# Altium schematic sheet CH340N_C2977777.schdoc
size 127 x 101 mm
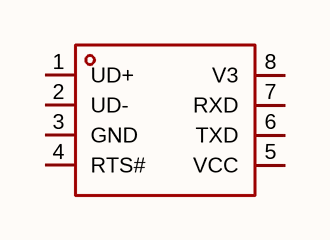
[diagram p0: CH340N_C2977777.schdoc]

## Parts
U?  ch340n  [SOP-8_L4.9-W3.9-P1.27-LS6.0-BL]  (value not drawn)

## Nets

Not connected (* = marked no-connect by the designer): U? 1(UD+) 2(UD-) 3(GND) 4(RTS#) 5(VCC) 6(TXD) 7(RXD) 8(V3)

## Library data of the parts
U? = ch340n: 应用功能:USB转串口;USB协议版本:USB 2.0;通道数:1;数据速率:2Mbps;; Manufacturer: WCH(南京沁恒); Symbol: CH340N_C2977777; AddInBom: yes; ModelId: 75c24a7891ee4dd6bdac16a7163ff87e; ModelName: SOP-8_L4.9-W3.9-P1.27-LS6.0-BL-1; ModelTransform: 192.913,236.22,0,0,0,0,-0.393,2.749,0; Applications Function: USB转串口; USB Protocol: USB 2.0; Number of Channels: 1; Voltage - Supply: 3.3V；5V; Data Rate: 2Mbps; LCSC Part Name: USB2.0芯片CH340; SupplierPart: C2977777; ManufacturerPart: CH340N; Supplier Footprint: SOP-8; JLCPCB Part Class: Extended Part; Datasheet: https://item.szlcsc.com/datasheet/CH340N/3390257.html; Supplier: LCSC; ConvertToPcb: yes; FootprintName: SOP-8_L4.9-W3.9-P1.27-LS6.0-BL; Operating Temperature: -20℃~+70℃; Features: 可编程波特率；内置时钟发生器；上电复位